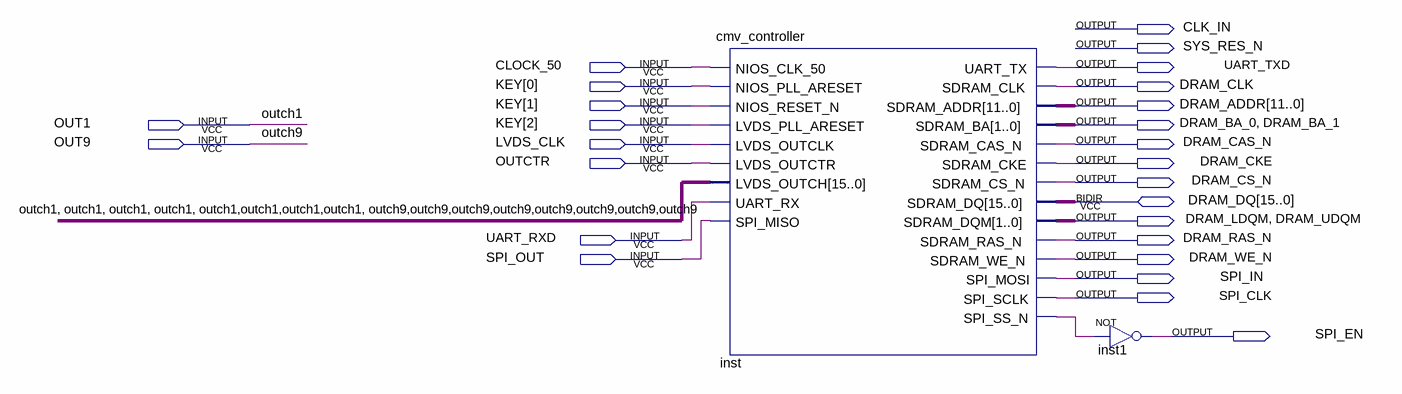
[diagram p0: schematic sheet]
// Quartus schematic de2_cyclone2.bdf as structural Verilog: 2 symbols, 26 pins
module de2_cyclone2 (
  input  CLOCK_50,
  input  [2:0] KEY,
  input  OUT1,
  input  OUT9,
  input  LVDS_CLK,
  input  OUTCTR,
  input  UART_RXD,
  input  SPI_OUT,
  inout  [15:0] DRAM_DQ,
  output CLK_IN,
  output SYS_RES_N,
  output UART_TXD,
  output DRAM_CLK,
  output [11:0] DRAM_ADDR,
  output DRAM_BA_0,
  output DRAM_BA_1,
  output DRAM_CAS_N,
  output DRAM_CKE,
  output DRAM_CS_N,
  output DRAM_LDQM,
  output DRAM_UDQM,
  output DRAM_RAS_N,
  output DRAM_WE_N,
  output SPI_IN,
  output SPI_CLK,
  output SPI_EN
);

  wire inst_spi_ss_n;

  cmv_controller inst (
    .NIOS_CLK_50(CLOCK_50), .NIOS_PLL_ARESET(KEY[0]), .NIOS_RESET_N(KEY[1]), .LVDS_PLL_ARESET(KEY[2]),
    .LVDS_OUTCLK(LVDS_CLK), .LVDS_OUTCTR(OUTCTR), .LVDS_OUTCH({{8{OUT1}}, {8{OUT9}}}), .UART_RX(UART_RXD),
    .SPI_MISO(SPI_OUT), .UART_TX(UART_TXD), .SDRAM_CLK(DRAM_CLK), .SDRAM_ADDR(DRAM_ADDR),
    .SDRAM_BA({DRAM_BA_0, DRAM_BA_1}), .SDRAM_CAS_N(DRAM_CAS_N), .SDRAM_CKE(DRAM_CKE),
    .SDRAM_CS_N(DRAM_CS_N), .SDRAM_DQM({DRAM_LDQM, DRAM_UDQM}), .SDRAM_RAS_N(DRAM_RAS_N),
    .SDRAM_WE_N(DRAM_WE_N), .SPI_MOSI(SPI_IN), .SPI_SCLK(SPI_CLK), .SPI_SS_N(inst_spi_ss_n),
    .SDRAM_DQ(DRAM_DQ));
  not inst1 (SPI_EN, inst_spi_ss_n);

  // Other names for the same wires on the sheet: outch1 = OUT1; outch9 = OUT9
endmodule
